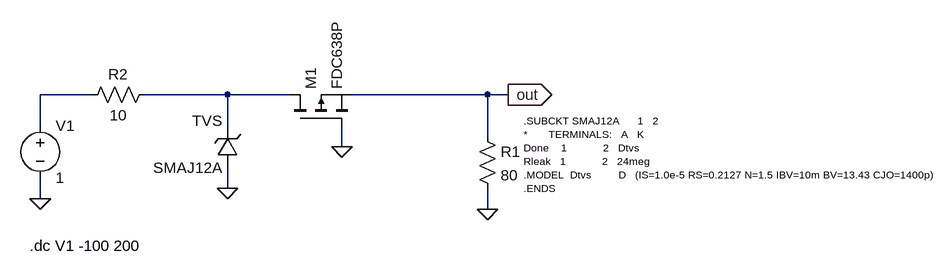
[diagram p0: schematic ReverseCurrent&TVS_PowerSupplyIn_PMOS.asc]
ReverseCurrent&TVS_PowerSupplyIn_PMOS.asc, the LTspice schematic file:
Version 4
SHEET 1 1436 944
WIRE -288 0 -368 0
WIRE -80 0 -208 0
WIRE 16 0 -80 0
WIRE 320 0 112 0
WIRE 352 0 320 0
WIRE -368 48 -368 0
WIRE -80 48 -80 0
WIRE 320 64 320 0
WIRE 96 80 96 48
WIRE -80 144 -80 112
WIRE -368 160 -368 128
WIRE 320 176 320 144
FLAG -80 144 0
FLAG 96 80 0
FLAG -368 160 0
FLAG 352 0 out
IOPIN 352 0 Out
FLAG 320 176 0
SYMBOL EXTRA\\DIODES.COM\\ZENER\\LIB\\zener -64 112 R180
WINDOW 0 24 72 Left 2
WINDOW 3 24 0 Left 2
SYMATTR InstName TVS
SYMATTR Value SMAJ12A
SYMATTR Prefix X
SYMBOL voltage -368 32 R0
SYMATTR InstName V1
SYMATTR Value 1
SYMBOL res 304 48 R0
SYMATTR InstName R1
SYMATTR Value 80
SYMBOL res -192 -16 R90
WINDOW 0 0 56 VBottom 2
WINDOW 3 32 56 VTop 2
SYMATTR InstName R2
SYMATTR Value 10
SYMBOL pmos 16 48 R270
SYMATTR InstName M1
SYMATTR Value FDC638P
TEXT -384 232 Left 2 !.dc V1 -100 200
TEXT 376 40 Left 1 !.SUBCKT SMAJ12A      1   2\n*       TERMINALS:   A   K\nDone    1            2   Dtvs\nRleak   1            2   24meg\n.MODEL  Dtvs         D   (IS=1.0e-5 RS=0.2127 N=1.5 IBV=10m BV=13.43 CJO=1400p)\n.ENDS

The netlist it stands for:
* ReverseCurrent&TVS_PowerSupplyIn_PMOS.asc
XTVS 0 N002 SMAJ12A  ; pins + -
V1 N001 0 1
R1 out 0 80
R2 N002 N001 10
M1 N002 0 out out FDC638P
.model NMOS NMOS
.model PMOS PMOS
.lib standard.mos
.dc V1 -100 200
.SUBCKT SMAJ12A      1   2
*       TERMINALS:   A   K
Done    1            2   Dtvs
Rleak   1            2   24meg
.MODEL  Dtvs         D   (IS=1.0e-5 RS=0.2127 N=1.5 IBV=10m BV=13.43 CJO=1400p)
.ENDS
.backanno
.end